# Altium project Raspberry Pi Interface Board.PrjPcb
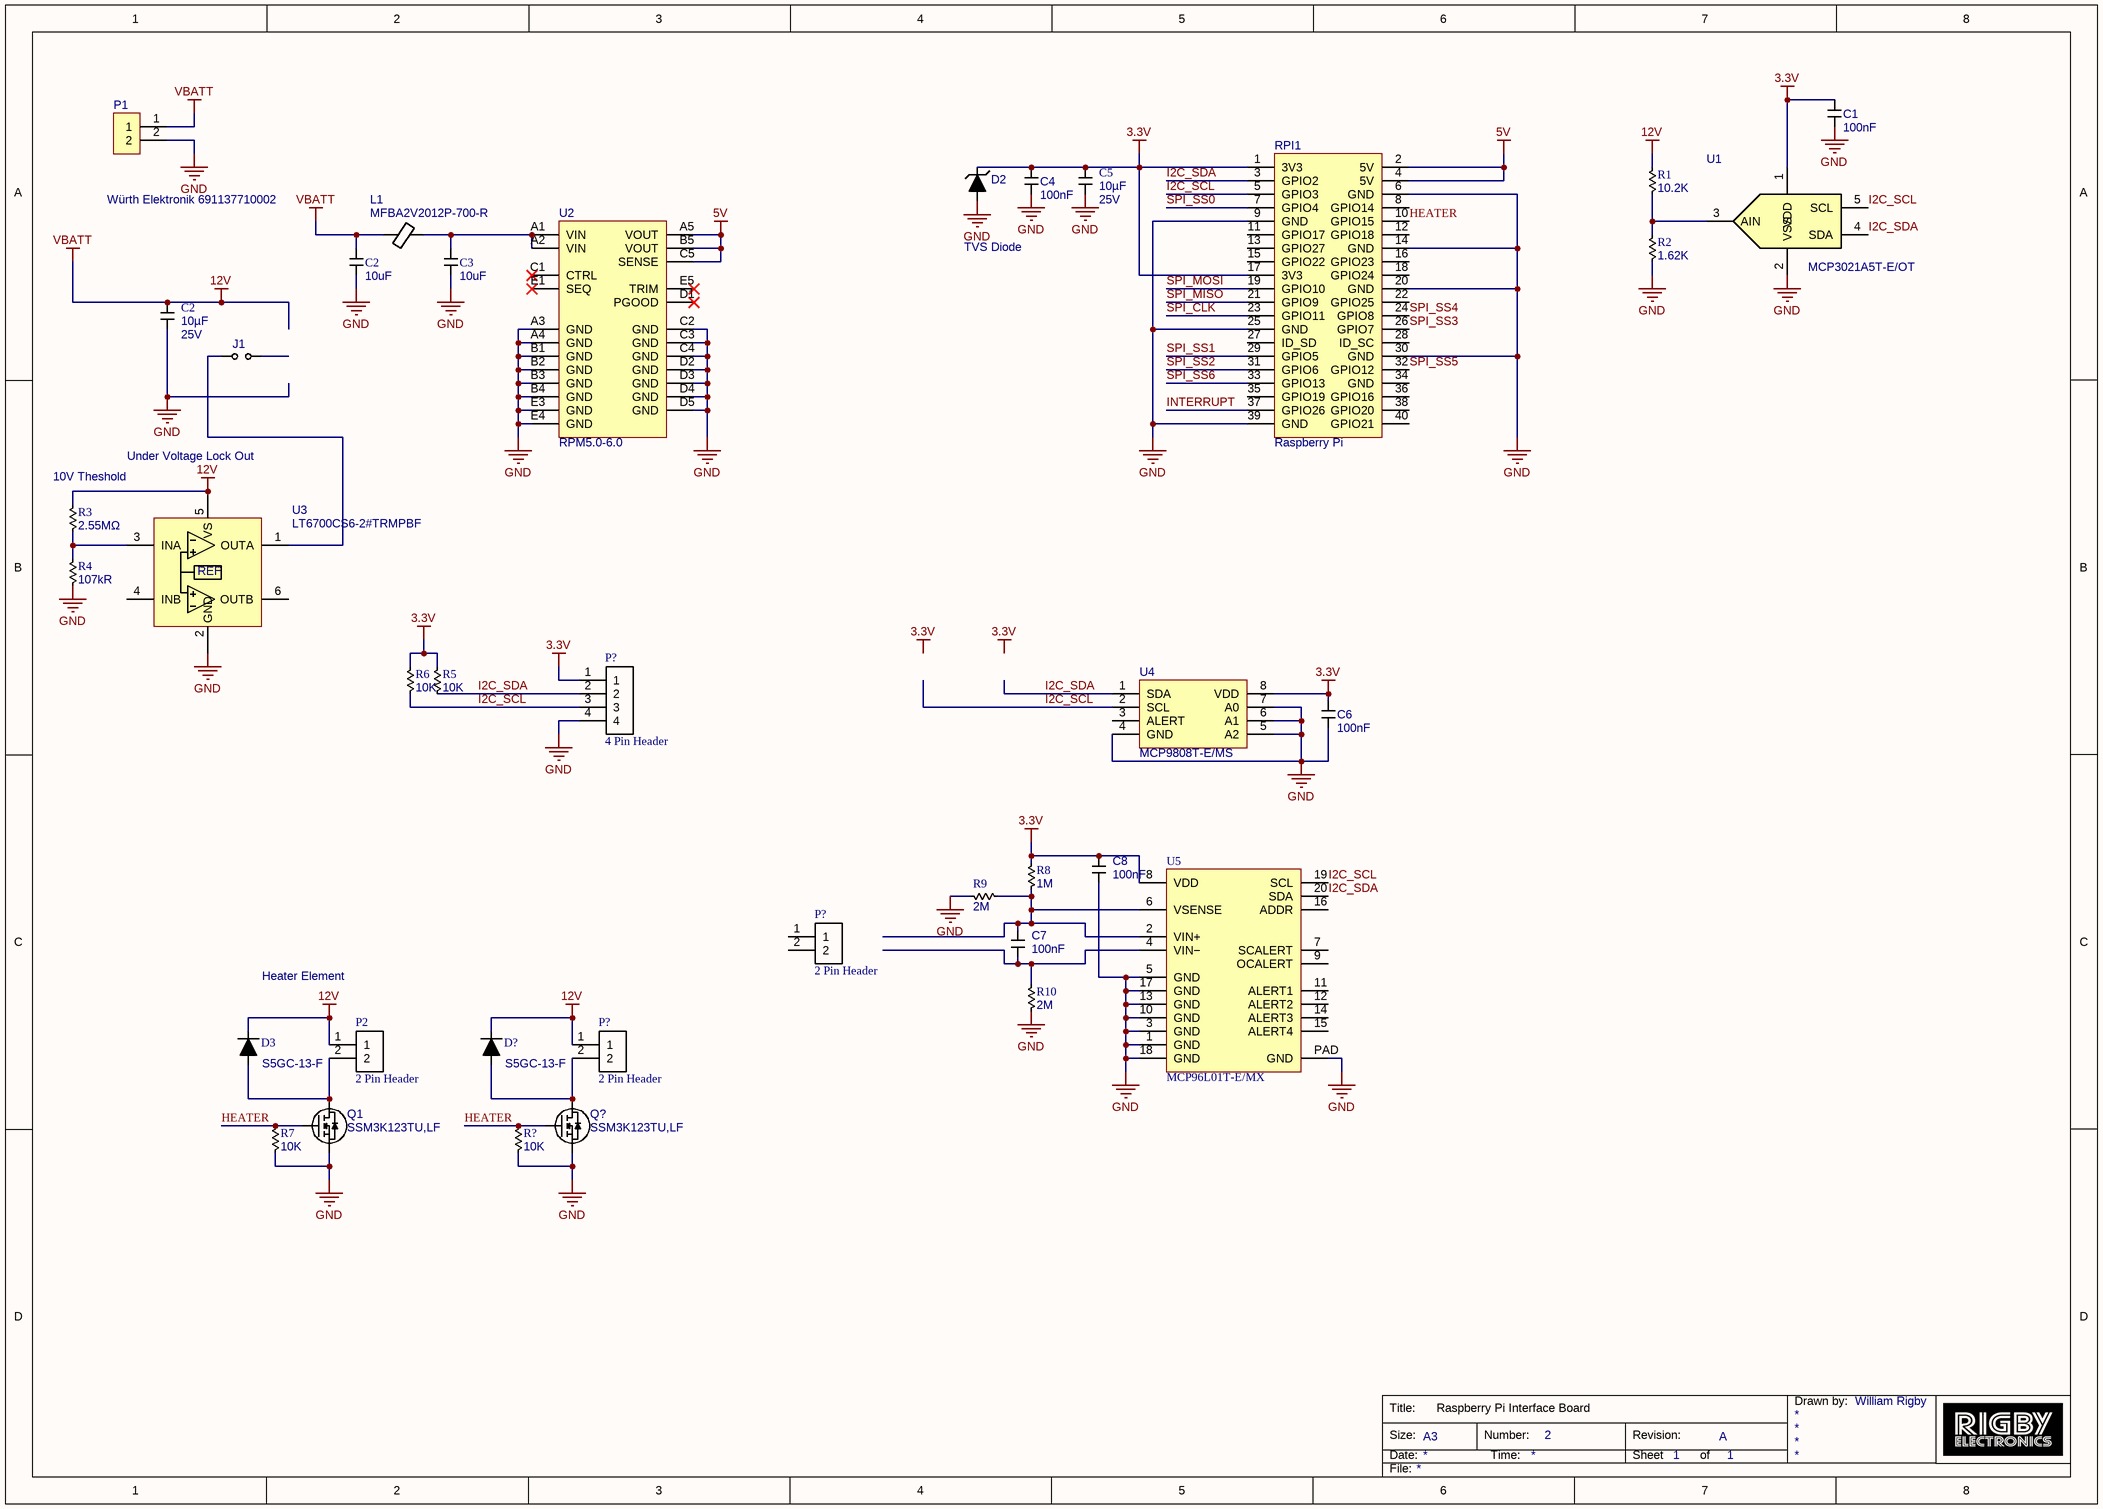
[diagram p0: Interface Board.SchDoc]
1 sheet, 38 parts. Net scope: global (net labels, ports and power ports of the same name join across sheets).

## Sheet Interface Board.SchDoc: Raspberry Pi Interface Board
size A3; DrawnBy: William Rigby; Engineer: William Rigby; DocumentNumber: 2; Revision: A; SheetNumber: 1; SheetTotal: 1

### Parts
(Parts that share a designator on the sheet are numbered #1, #2 ... from top to bottom, then left to right.)
C1  100nF  [C0805]
C2#1  Capacitance: 10uF  [C0805]  (hidden comment: F)
C2#2  Voltage Rating: 25V  Capacitance: 10µF  [C0805]  (hidden comment: F)
C3  Capacitance: 10uF  [C0805]  (hidden comment: F)
C4  100nF  [C0805]
C5  Voltage Rating: 25V  Capacitance: 10µF  [C0805]  (hidden comment: F)
C6  100nF  [C0805]
C7  100nF  [C0805]
C8  100nF  [C0805]
D2  TVS Diode  [SP4020-01FTG-C]
D3  S5GC-13-F  [SMC]
D?  S5GC-13-F  [SMC]
J1  Jumper 2 Pin  [Jumper 2 Pins]  (value not drawn)
L1  MFBA2V2012P-700-R  [0805]
P1  Würth Elektronik 691137710002  [Würth Elektronik 691137710002]
P2  2 Pin Header  [S2B-XH-A(LF)(SN)]
P?#1  4 Pin Header  [S4B-XH-A(LF)(SN)]
P?#2  2 Pin Header  [S2B-XH-A(LF)(SN)]
P?#3  2 Pin Header  [S2B-XH-A(LF)(SN)]
Q1  SSM3K123TU,LF  [SSM3K123TU,LF]
Q?  SSM3K123TU,LF  [SSM3K123TU,LF]
R1  Resistance: 10.2K  [R0805]  (hidden comment: 10.2kΩ)
R2  Resistance: 1.62K  [R0805]  (hidden comment: 1620Ω)
R3  Resistance: 2.55MΩ  [R0805]  (hidden comment: 107kΩ)
R4  Resistance: 107kR  [R0805]  (hidden comment: 107kΩ)
R5  Resistance: 10K  [R0805]  (hidden comment: 330Ω)
R6  Resistance: 10K  [R0805]  (hidden comment: 330Ω)
R7  Resistance: 10K  [R0805]  (hidden comment: 330Ω)
R8  Resistance: 1M  [R0805]  (hidden comment: 330Ω)
R9  Resistance: 2M  [R0805]  (hidden comment: 330Ω)
R10  Resistance: 2M  [R0805]  (hidden comment: 330Ω)
R?  Resistance: 10K  [R0805]  (hidden comment: 330Ω)
RPI1  Raspberry Pi  [Header 40]
U1  MCP3021A5T-E/OT  [MCP3021A5T-E/OT]
U2  RPM5.0-6.0  [RPM5.0-6.0]
U3  LT6700CS6-2#TRMPBF  [LT6700CS6-2#TRMPBF]
U4  MCP9808T-E/MS  [MCP9808T-E/MS]
U5  MCP96L01T-E/MX  [MCP96L01T-E/MX]

### Nets
3.3V: C1.1 C4.1 C5.1 C6.1 C8.1 D2.1 P?#1.1 R5.2 R6.2 R8.2 RPI1.1(3V3) RPI1.17(3V3) U1.1(VDD) U4.8(VDD) U5.8(VDD)
5V: RPI1.2(5V) RPI1.4(5V) U2.A5(VOUT) U2.B5(VOUT) U2.C5(SENSE)
12V: C2#1.1 C2#2.1 D3.1 D?.1 L1.1 P1.1 P2.1 P?#3.1 R1.2 R3.1 U3.5(VS)  [also labelled VBATT]
GND: C1.2 C2#1.2 C2#2.2 C3.2 C4.2 C5.2 C6.2 C8.2 D2.2 P1.2 P?#1.4 Q1.2 Q?.2 R2.1 R4.2 R7.1 R9.2 R10.2 R?.1 RPI1.6(GND) RPI1.9(GND) RPI1.14(GND) RPI1.20(GND) RPI1.25(GND) RPI1.30(GND) RPI1.39(GND) U1.2(VSS) U2.A3(GND) U2.A4(GND) U2.B1(GND) U2.B2(GND) U2.B3(GND) U2.B4(GND) U2.C2(GND) U2.C3(GND) U2.C4(GND) U2.D2(GND) U2.D3(GND) U2.D4(GND) U2.D5(GND) U2.E3(GND) U2.E4(GND) U3.2(GND) U4.4(GND) U4.5(A2) U4.6(A1) U4.7(A0) U5.1(GND) U5.3(GND) U5.5(GND) U5.10(GND) U5.13(GND) U5.17(GND) U5.18(GND) U5.PAD(GND)
HEATER: Q1.1 Q?.1 R7.2 R?.2 RPI1.10(GPIO15)
I2C_SCL: P?#1.3 R6.1 RPI1.5(GPIO3) U1.5(SCL) U4.2(SCL) U5.19(SCL)
I2C_SDA: P?#1.2 R5.1 RPI1.3(GPIO2) U1.4(SDA) U4.1(SDA) U5.20(SDA)
INTERRUPT: RPI1.37(GPIO26)
SPI_CLK: RPI1.23(GPIO11)
SPI_MISO: RPI1.21(GPIO9)
SPI_MOSI: RPI1.19(GPIO10)
SPI_SS0: RPI1.7(GPIO4)
SPI_SS1: RPI1.29(GPIO5)
SPI_SS2: RPI1.31(GPIO6)
SPI_SS3: RPI1.26(GPIO7)
SPI_SS4: RPI1.24(GPIO8)
SPI_SS5: RPI1.32(GPIO12)
SPI_SS6: RPI1.33(GPIO13)
NetC3_1: C3.1 L1.2 U2.A1(VIN) U2.A2(VIN)
NetC7_1: C7.1 R8.1 R9.1 U5.2(VIN+) U5.6(VSENSE)
NetC7_2: C7.2 R10.1 U5.4(VIN−)
NetD3_2: D3.2 P2.2 Q1.3
NetD?_2: D?.2 P?#3.2 Q?.3
NetJ1_2: J1.2 U3.1(OUTA)
NetR1_1: R1.1 R2.2 U1.3(AIN)
NetR3_2: R3.2 R4.1 U3.3(INA)

Not connected (* = marked no-connect by the designer): J1 1; P?#2 1 2; RPI1 8(GPIO14) 11(GPIO17) 12(GPIO18) 13(GPIO27) 15(GPIO22) 16(GPIO23) 18(GPIO24) 22(GPIO25) 27(ID_SD) 28(ID_SC) 34(GND) 35(GPIO19) 36(GPIO16) 38(GPIO20) 40(GPIO21); U2 C1(CTRL)* D1(PGOOD)* E1(SEQ)* E5(TRIM)*; U3 4(INB) 6(OUTB); U4 3(ALERT); U5 7(SCALERT) 9(OCALERT) 11(ALERT1) 12(ALERT2) 14(ALERT3) 15(ALERT4) 16(ADDR)

### Notes on the sheet
- (near R3) 10V Theshold
- Under Voltage Lock Out
- Heater Element
- Labels drawn without touching a wire or pin: 3.3V
- Title:
- Size:
- Date:
- A3
- Number:
- Time:
- Revision:
- Sheet
- of
- Drawn by:
- File:
- (in symbol LT6700CS6-2#TRMPBF) REF

### Library data of the parts
C1 C4 C6-C8 = Capacitor: Manufacturer: YAGEO; Manufacturer Part Number: CC0805KRX7R9BB104; Tolerance: ±10%; Temperature Coefficient: X7R; Voltage Rating: 50V; Supplier: Digi-Key Electronics; Supplier Part Number: 311-1140-1-ND; Capacitance: 100nF
C2#1 C3 = Capacitor: Manufacturer: Murata Electronics; Manufacturer Part Number: GRM21BZ71E106KE15L; Voltage Rating: 25V; Supplier: Digi-Key Electronics; Supplier Part Number: 490-GRM21BZ71E106KE15LCT-ND; Price: 0.03
C2#2 C5 = Capacitor: Manufacturer: Samsung Electro-Mechanics; Manufacturer Part Number: CL21A106KAYNNNG; Supplier: Digi-Key Electronics; Supplier Part Number: 1276-6454-1-ND; Price: 0.28
D2 = Diode TVS: Manufacturer: Littelfuse Inc.; Supplier: Digi-Key Electronics; Supplier Part Number: F6271CT-ND; Manufacturer Part Number: SP4020-01FTG-C
D3 D? = Diode: Manufacturer: Diodes Incorporated; Current Rating: 5A; Voltage: 400V; Supplier: Digi-Key Electronics; Supplier Part Number: S5GC-FDICT-ND; Manufacturer Part Number: S5GC-13-F
J1 = Jumper 2 Pin: 2 Pin Jumper
L1 = Ferrite Bead: Manufacturer: Eaton - Electronics Division; Impedance @ Frequency: 70 Ohms @ 100 MHz; Current Rating: 6A; Supplier: Digi-Key Electronics; Supplier Part Number: 283-MFBA2V2012P-700-RCT-ND; Manufacturer Part Number: MFBA2V2012P-700-R
P1 = Würth Elektronik 691137710002: 2 Position Wire to Board Terminal Block Horizontal with Board 0.197" (5.00mm) Through Hole; Positions: 2; Voltage Rating: 300V; Current Rating: 16A; Wire Gauge: 12-30AWG; Manufacturer: Würth Elektronik; Manufacturer Part Number: 691137710002; Supplier: Digi-Key Electronics; Supplier Part Number: 732-10955-ND
P2 P?#2 P?#3 = Header 2
P?#1 = Header 4: Manufacturer: *; Manufacturer Part Number: *; Supplier: *; Supplier Part Number: *
Q1 Q? = SSM3K123TU,LF: N-Channel 20 V 4.2A (Ta) 500mW (Ta) Surface Mount UFM; Manufacturer: Toshiba Semiconductor and Storage; Supplier: Digi-Key Electronics; Supplier Part Number: SSM3K123TULFCT-ND; Manufactuer Part Number: SSM3K123TU,LF
R1 = Resistor: Standard Resistor; Manufacturer: YAGEO; Manufacturer Part Number: RC0805FR-0710K2L; Power Rating: 1/8W; Supplier: Digi-Key Electronics; Supplier Part Number: 311-10.2KCRCT-ND; Price: 0.16
R2 = Resistor: Standard Resistor; Manufacturer: YAGEO; Manufacturer Part Number: RC0805FR-071K62L; Power Rating: 1/8W; Supplier: Digi-Key Electronics; Supplier Part Number: 311-1.62KCRCT-ND; Price: 0.16
R3 = Resistor: Standard Resistor; Manufacturer: YAGEO; Manufacturer Part Number: RC0805FR-072M55L; Power Rating: 0.125W; Supplier: Digi-Key Electronics; Supplier Part Number: 311-2.55MCRCT-ND; Price: 0.16
R4 = Resistor: Standard Resistor; Manufacturer: YAGEO; Manufacturer Part Number: RC0805FR-07107KL; Power Rating: 0.125W; Supplier: Digi-Key Electronics; Supplier Part Number: 311-107KCRCT-ND; Price: 0.16
R5-R7 R? = Resistor: Standard Resistor; Manufacturer: YAGEO; Manufacturer Part Number: RC0805JR-0710KL; Power Rating: 1/8W; Supplier: Digi-Key Electronics; Supplier Part Number: 311-10KARCT-ND; Price: 0.16
R8 = Resistor: Standard Resistor; Manufacturer: Panasonic Electronic Components; Manufacturer Part Number: ERA-6AEB105V; Power Rating: 1/8W; Supplier: Digi-Key Electronics; Supplier Part Number: P1MDACT-ND; Price: 0.16
R9 R10 = Resistor: Standard Resistor; Manufacturer: Vishay Dale; Manufacturer Part Number: CRCW08052M00FKECC; Power Rating: 1/8W; Supplier: Digi-Key Electronics; Supplier Part Number: 541-4129-1-ND; Price: 0.16
RPI1 = Raspberry Pi 40 Pin Header
U1 = MCP3021A5T-E/OT: 10 Bit Analog to Digital Converter 1 Input 1 SAR SOT-23-5; Manufacturer: Microchip Technology; Manufacturer Part Number: MCP3021A5T-E/OT; Supplier: Digi-Key Electronics; Supplier Part Number: MCP3021A5T-E/OTCT-ND
U2 = RPM5.0-6.0: Non-Isolated PoL Module DC DC Converter 1 Output 5V 6A 4V - 15V Input; Manufacturer: Recom Power; Voltage Input: 4 - 15V; Supplier: Digi-Key Electronics; Supplier Part Number: 945-RPM5.0-6.0CT-ND; Manufacturer Part Number: RPM5.0-6.0; Output Voltage: 5V; Output Current: 6A
U3 = LT6700CS6-2#TRMPBF: Comparator with Voltage Reference Open-Collector TSOT-23-6; Manufacturer: Analog Devices Inc.; Manufacturer Part Number: LT6700CS6-2#TRMPBF; Supplier: Digi-Key Electronics; Supplier Part Number: 505-LT6700CS6-2#TRMPBFCT-ND
U4 = MCP9808T-E/MS: Temperature Sensor Digital, Local -40°C ~ 125°C 12 b 8-MSOP; Manufacturer: Microchip Technology; Supplier: Digi-Key Electronics; Supplier Part Number: MCP9808T-E/MSCT-ND; Manufacturer Part Number: MCP9808T-E/MS
U5 = MCP96L01T-E/MX: Thermocouple EMF to Temperature Converter,  ±1.5°C Maximum Accuracy; Manufacturer: Microchip Technology; Supplier: Digi-Key Electronics; Manufacturer Part Number: MCP96L01T-E/MX; Supplier Part Number: 150-MCP96L01T-E/MXCT-ND